# Altium project Primary_Converter.PrjPcb
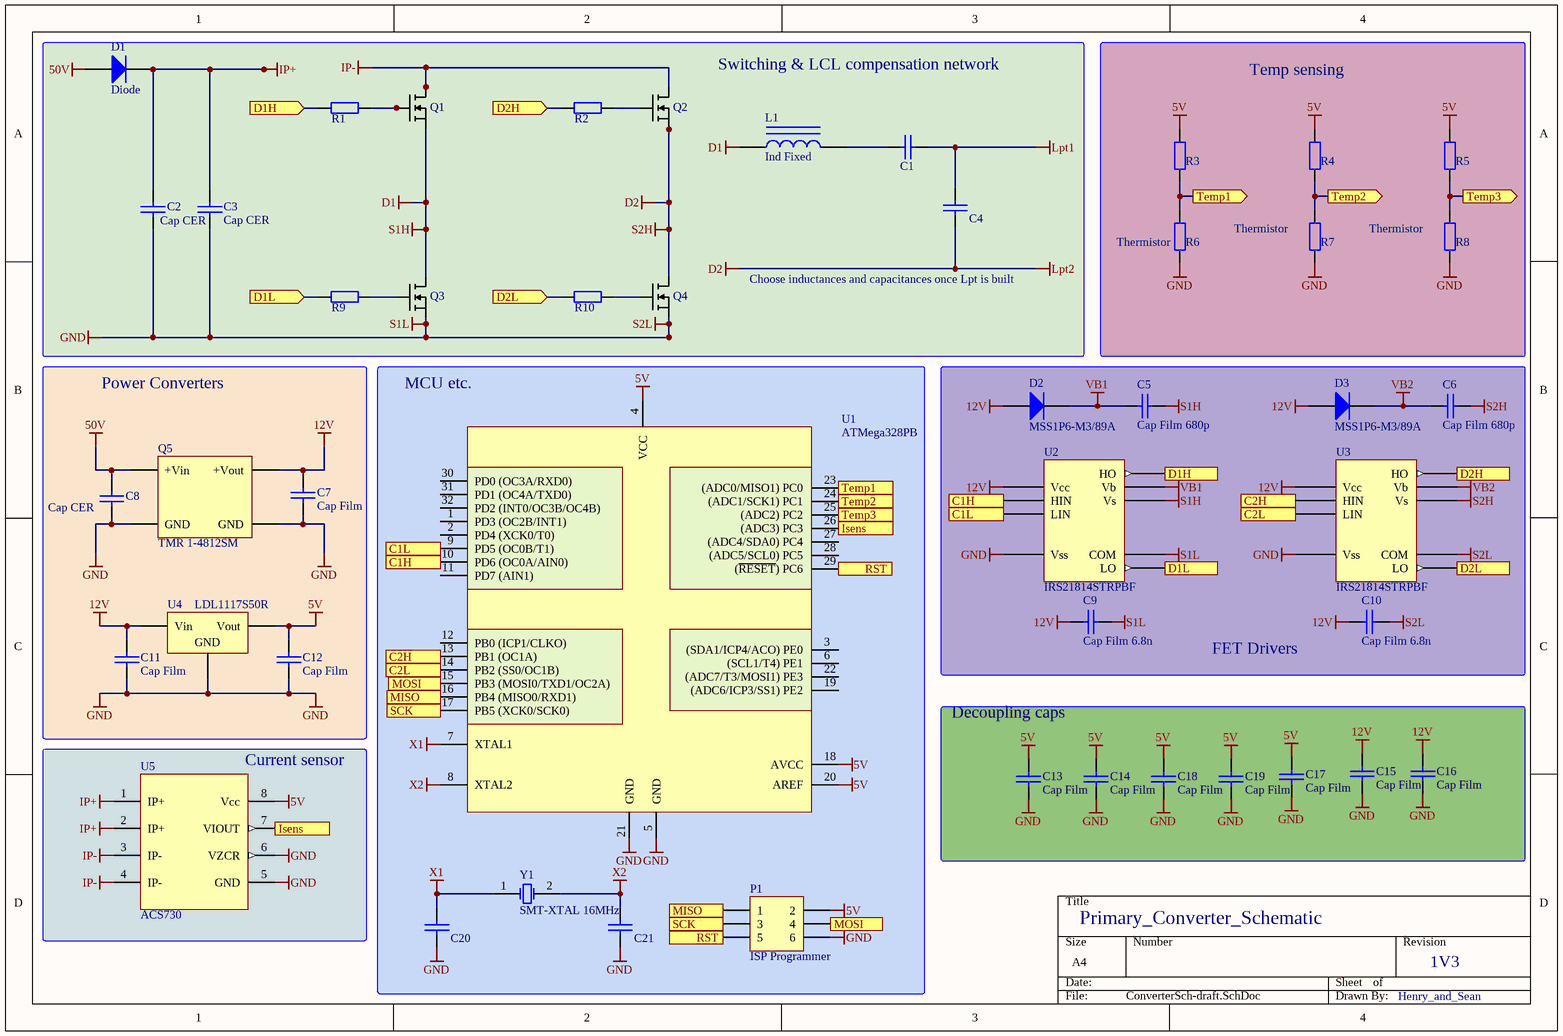
[diagram p0: ConverterSch-draft.SchDoc]
Version: 1V3; main_title: Primary_Converter_Schematic; main_author: Henry_and_Sean
1 sheet, 47 parts. Net scope: flat (ports and power ports of the same name join across sheets).

## Sheet ConverterSch-draft.SchDoc
size A4

### Parts
C1  CCAPCAA572  [CAA572]  (value not drawn)
C2  Cap CER  [C1206]
C3  Cap CER  [C1206]
C4  Capacitor 0805  [C0805]  (value not drawn)
C5  Cap Film 680p  [LDECE4150KA0N00]
C6  Cap Film 680p  [LDECE4150KA0N00]
C7  Cap Film  [LDECE4150KA0N00]
C8  Cap CER  [C1206]
C9  Cap Film 6.8n  [LDECE4150KA0N00]
C10  Cap Film 6.8n  [LDECE4150KA0N00]
C11  Cap Film  [LDECE4150KA0N00]
C12  Cap Film  [LDECE4150KA0N00]
C13  Cap Film  [LDECE4150KA0N00]
C14  Cap Film  [LDECE4150KA0N00]
C15  Cap Film  [LDECE4150KA0N00]
C16  Cap Film  [LDECE4150KA0N00]
C17  Cap Film  [LDECE4150KA0N00]
C18  Cap Film  [LDECE4150KA0N00]
C19  Cap Film  [LDECE4150KA0N00]
C20  Capacitor 0805  [C0805]  (value not drawn)
C21  Capacitor 0805  [C0805]  (value not drawn)
D1  Diode  [SMC]
D2  MSS1P6-M3/89A  [MicroSMP (DO-219AD)]
D3  MSS1P6-M3/89A  [MicroSMP (DO-219AD)]
L1  Ind Fixed  [7447709101]
P1  ISP Programmer  [HDR2X3]
Q1  IRLML2060TRPbF  [IRLML2060TRPbF]  (value not drawn)
Q2  IRLML2060TRPbF  [IRLML2060TRPbF]  (value not drawn)
Q3  IRLML2060TRPbF  [IRLML2060TRPbF]  (value not drawn)
Q4  IRLML2060TRPbF  [IRLML2060TRPbF]  (value not drawn)
Q5  TMR 1-4812SM  [TMR 1-4812SM Footprint]
R1  Resistor 1206  [R1206]  (value not drawn)
R2  Resistor 1206  [R1206]  (value not drawn)
R3  Resistor 0805  [R0805]  (value not drawn)
R4  Resistor 0805  [R0805]  (value not drawn)
R5  Resistor 0805  [R0805]  (value not drawn)
R6  Resistor 0805  [R0805]  (value not drawn)
R7  Resistor 0805  [R0805]  (value not drawn)
R8  Resistor 0805  [R0805]  (value not drawn)
R9  Resistor 1206  [R1206]  (value not drawn)
R10  Resistor 1206  [R1206]  (value not drawn)
U1  ATMega328PB  [TQFP32]
U2  IRS21814STRPBF  [SOIC127P600X175-14N]
U3  IRS21814STRPBF  [SOIC127P600X175-14N]
U4  LDL1117S50R  [SOT223L]
U5  ACS730  [SOIC8]
Y1  SMT-XTAL 16MHz  [HC49-US]

### Blocks framed on the sheet
Switching & LCL compensation network: C1-C4 D1 L1 Q1-Q4 R1 R2 R9 R10
Temp sensing: R3-R8
Power Converters: C7 C8 C11 C12 Q5 U4
MCU etc.: C20 C21 P1 U1 Y1
FET Drivers: C5 C6 C9 C10 D2 D3 U2 U3
Decoupling caps: C13-C19
Current sensor: U5

### Ports
C1H (in), C1L (in), C2H (in), C2L (in), D1H (in), D1H (out), D1L (in), D1L (out), D2H (in), D2H (out), D2L (in), D2L (out), Isens (in), Isens (out), MISO (in), MISO (out), MOSI (in), MOSI (out), RST (in), RST (out), SCK (in), SCK (out), Temp1 (in), Temp1 (out), Temp2 (in), Temp2 (out), Temp3 (in), Temp3 (out)

### Nets
5V: C12.2 C13.2 C14.2 C17.2 C18.2 C19.2 P1.2 R3.2 R4.2 R5.2 U1.4(VCC) U1.18(AVCC) U1.20(AREF) U4.2(Vout) U5.8(Vcc)
12V: C7.2 C9.2 C10.2 C11.2 C15.2 C16.2 D2.1(A) D3.1(A) Q5.3(+Vout) U2.7(Vcc) U3.7(Vcc) U4.3(Vin)
50V: C8.2 Q5.1(+Vin)
D1: C5.1 L1.1 Q1.2(S) Q3.1(D) U2.11(Vs)  [also labelled S1H]
D2: C4.1 C6.1 Q2.2(S) Q4.1(D) U3.11(Vs)  [also labelled Lpt2, S2H]
GND: C2.1 C3.1 C7.1 C8.1 C9.1 C10.1 C11.1 C12.1 C13.1 C14.1 C15.1 C16.1 C17.1 C18.1 C19.1 C20.2 C21.2 P1.6 Q3.2(S) Q4.2(S) Q5.0(GND) Q5.2(GND) R6.1 R7.1 R8.1 U1.5(GND) U1.21(GND) U2.3(Vss) U2.5(COM) U3.3(Vss) U3.5(COM) U4.1(GND) U5.5(GND) U5.6(VZCR)  [also labelled S1L, S2L]
IP+: C2.2 C3.2 D1.2(K) U5.1(IP+) U5.2(IP+)
IP-: Q1.1(D) Q2.1(D) U5.3(IP-) U5.4(IP-)
Lpt1: C1.1 C4.2
VB1: C5.2 D2.2(K) U2.13(Vb)
VB2: C6.2 D3.2(K) U3.13(Vb)
X1: C20.1 U1.7(XTAL1) Y1.1(OSC1)
X2: C21.1 U1.8(XTAL2) Y1.2(OSC2)
NetC1_2: C1.2 L1.2
NetP1_1: P1.1 U1.16(PB4_(MISO0/RXD1)) ; port MISO
NetP1_3: P1.3 U1.17(PB5_(XCK0/SCK0)) ; port SCK
NetP1_4: P1.4 U1.15(PB3_(MOSI0/TXD1/OC2A)) ; port MOSI
NetP1_5: P1.5 U1.29((~{RESET})_PC6) ; port RST
NetQ1_0: Q1.0(G) R1.2
NetQ2_0: Q2.0(G) R2.2
NetQ3_0: Q3.0(G) R9.2
NetQ4_0: Q4.0(G) R10.2
NetR1_1: R1.1 U2.12(HO) ; port D1H
NetR2_1: R2.1 U3.12(HO) ; port D2H
NetR3_1: R3.1 R6.2 U1.23((ADC0/MISO1)_PC0) ; port Temp1
NetR4_1: R4.1 R7.2 U1.24((ADC1/SCK1)_PC1) ; port Temp2
NetR5_1: R5.1 R8.2 U1.25((ADC2)_PC2) ; port Temp3
NetR9_1: R9.1 U2.6(LO) ; port D1L
NetR10_1: R10.1 U3.6(LO) ; port D2L
NetU1_9: U1.9(PD5_(OC0B/T1)) U2.2(LIN) ; port C1L
NetU1_10: U1.10(PD6_(OC0A/AIN0)) U2.1(HIN) ; port C1H
NetU1_13: U1.13(PB1_(OC1A)) U3.1(HIN) ; port C2H
NetU1_14: U1.14(PB2_(SS0/OC1B)) U3.2(LIN) ; port C2L
NetU1_26: U1.26((ADC3)_PC3) U5.7(VIOUT) ; port Isens

Not connected (* = marked no-connect by the designer): D1 1(A); U1 1(PD3_(OC2B/INT1)) 2(PD4_(XCK0/T0)) 3((SDA1/ICP4/ACO)_PE0) 6((SCL1/T4)_PE1) 11(PD7_(AIN1)) 12(PB0_(ICP1/CLKO)) 19((ADC6/ICP3/SS1)_PE2) 22((ADC7/T3/MOSI1)_PE3) 27((ADC4/SDA0)_PC4) 28((ADC5/SCL0)_PC5) 30(PD0_(OC3A/RXD0)) 31(PD1_(OC4A/TXD0)) 32(PD2_(INT0/OC3B/OC4B))

### Notes on the sheet
- (near R6) Thermistor
- (near R7) Thermistor
- (near R8) Thermistor
- Choose inductances and capacitances once Lpt is built
- Labels drawn without touching a wire or pin: 50V

### Library data of the parts
C1 = CCAPCAA572: CAA572 ceramic caps; Type: Surface Mount; MPN: ?; Part Description: ?; Value: ?
C2 C3 C8 = Cap CER Decoup C3216C0G2A104J160AC: CAP CER 0.1UF 100V C0G 1206; Manufacturer: TDK Corporation; Type: Surface mount; Value: 100nF/100V; Supplier 1: RSComponents; Supplier Part Number 1: 1795799; MPN: C3216C0G2A104J160AC; Supplier 2: Element14; Part Description: CAP CER 0.1UF 100V C0G 1206; Supplier Part Number 4: 810-C3216C0G2A104J6C; Supplier Part Number 3: 445-172677-1-ND; Supplier Part Number 2: 2906828; Supplier 4: Mouser; Supplier 3: Digi-Key
C4 = CCAP0805: Type: Surface Mount; MPN: ?; Value: ?; Part Description: ?
C5 C6 C9 C10 = Cap Film SMD LDECE4150KA0N00: CAP FILM 1.5UF 10% 50VDC 2824; Manufacturer: KEMET; Type: Surface mount; MPN: LDECE4150KA0N00; Supplier 1: Element14; Supplier 2: RSComponents; Part Description: CAP FILM 1.5UF 10% 50VDC 2824; Supplier Part Number 4: 80-LDECE4150KA0N00; Supplier Part Number 3: 399-12858-1-ND; Supplier Part Number 2: 1650342; Supplier Part Number 1: 2495712; Supplier 4: Mouser; Supplier 3: Digi-Key
  C5 C6: Value: 680p
  C9 C10: Value: 6.8n
C7 C11-C19 = Cap Film SMD LDECE4150KA0N00: CAP FILM 1.5UF 10% 50VDC 2824; Manufacturer: KEMET; Type: Surface mount; Value: 1.5uF/50V; MPN: LDECE4150KA0N00; Supplier 1: Element14; Supplier 2: RSComponents; Part Description: CAP FILM 1.5UF 10% 50VDC 2824; Supplier Part Number 4: 80-LDECE4150KA0N00; Supplier Part Number 3: 399-12858-1-ND; Supplier Part Number 2: 1650342; Supplier Part Number 1: 2495712; Supplier 4: Mouser; Supplier 3: Digi-Key
C20 C21 = CCAP0805
D1 = Diode: Default Diode; Published: 8-Jun-2000; LatestRevisionDate: 17-Jul-2002; LatestRevisionNote: Re-released for DXP Platform.; PackageVersion: Sep-1996; PackageReference: SMC; Publisher: Altium Limited; PackageDescription: DO-214-AB/SMC; 2 C-Bend Leads; Body 7.9 x 5.9 mm, inc. leads (LxW); Code_JEDEC: DO-214-AB
D2 D3 = Diode MSS1P6-M3/89A: DIODE SCHOTTKY 60V 1A MICROSMP; Manufacturer: Vishay Semiconductor Diodes Division; Type: Surface mount; MPN: MSS1P6-M3/89A; Supplier 1: RSComponents; Supplier 2: Element14; Part Description: DIODE SCHOTTKY 60V 1A MICROSMP; Supplier Part Number 2: 2335157; Supplier Part Number 1: 7103070P
L1 = Ind SMD 7447709101: FIXED IND 100UH 2.5A 110 MOHM; Manufacturer: Würth Elektronik; Type: Surface mount; Value: 100uH/2.5A; MPN: 7447709101; Supplier 1: Element14; Supplier 2: RSComponents; Part Description: FIXED IND 100UH 2.5A 110 MOHM; Supplier Part Number 1: 1635948; Supplier Part Number 2: 1241890P; Supplier Part Number 4: 710-7447709101; Supplier Part Number 3: 732-1248-2-ND; Supplier 4: Mouser; Supplier 3: Digi-Key
P1 = Header 3X2: Header, 3-Pin, Dual row; LatestRevisionDate: 17-Jul-2002; LatestRevisionNote: Re-released for DXP Platform.; Publisher: Altium Limited
Q1-Q4 = IRLML2060TRPbF: IRLML2060TRPbF N-Channel MOSFET; ComponentLink1Description: Datasheet; ComponentLink1URL: https://www.infineon.com/dgdl/irlml2060pbf.pdf?fileId=5546d462533600a401535664b7fb25ee
Q5 = TMR 1-4812SM: DC-DC SM Regulator; ComponentLink1Description: Datasheet; ComponentLink1URL: https://www.tracopower.com/products/tmr1sm.pdf
R1 R2 R9 R10 = RES1206: MPN: ?; Type: Surface Mount; Value: ?; Part Description: ?
R3-R8 = RES0805
U1 = ATMega328PB: IC MCU 8BIT 32KB FLASH 32TQFP; Supplier 1: Digi-Key; Supplier Part Number 1: ATMEGA328PB-AU-ND; Supplier 2: Digikey; Supplier Part Number 2: ATMEGA328PB-AU-ND
U2 U3 = IRS21814STRPBF: IC GATE DRVR HALF-BRIDGE 14SOIC; Manufacturer: Infineon Technologies; MPN: IRS21814STRPBF; Supplier 1: Element14; Type: Surface mount; Part Description: IC GATE DRVR HALF-BRIDGE 14SOIC; Supplier Part Number 2: IRS21814STRPBFCT-ND; Supplier Part Number 1: 3234273; Supplier 3: Mouser; Supplier 2: Digi-Key; Supplier Part Number 3: 942-IRS21814STRPBF
U4 = LDO LDL1117S33R: IC REG LINEAR 3.3V 1.2A SOT223; Manufacturer: STMicroelectronics; Value: 3.3V/1.2A; MPN: LDL1117S33R; Supplier 1: Element14; Type: Surface mount; Part Description: IC REG LINEAR 3.3V 1.2A SOT223; Supplier Part Number 3: 511-LDL1117S33R; Supplier Part Number 2: 497-17239-1-ND; Supplier Part Number 1: 2729708; Supplier 3: Mouser; Supplier 2: Digi-Key
Y1 = TXC9C-16_XTAL_SMT: 9C-16.000MAAJ-T crystal 16.0000MHZ 18PF SMD; Manufacturer: TXC CORPORATION; Frequency Stability: ±30ppm; Operating Mode: Fundamental; Supplier 1: Digi-Key; Manufacturer Part Number: 9C-16.000MAAJ-T; RoHS: RoHS Compliant; Category: Crystals, Oscillators, Resonators; Stock 1: 11514; Pricing 1: 1=0.75, 10=0.628, 50=0.5656, 100=0.5026, 500=0.47744 (NZD); Packaging: Cut Tape (CT); Part Status: Active; Type: MHz Crystal; Frequency Tolerance: ±30ppm; Load Capacitance: 18pF; Operating Temperature: -20°C ~ 70°C; Ratings: -; Mounting Type: Surface Mount; Package / Case: HC-49/US; Size / Dimension: 0.449" L x 0.189" W (11.40mm x 4.80mm); Height - Seated (Max): 0.161" (4.10mm); ComponentLink1URL: http://www.txccorp.com/download/products/quartz_crystals/2015TXC_9C_32.pdf; ComponentLink1Description: http://www.txccorp.com/download/products/quartz_crystals/2015TXC_9C_32.pdf; Supplier Part Number 1: 887-1059-1-ND
U5 = ACS730: Supplier 1: Digikey; Supplier Part Number 1: 620-1794-6-ND